# Altium schematic sheet STM32H750.SchDoc
size A3
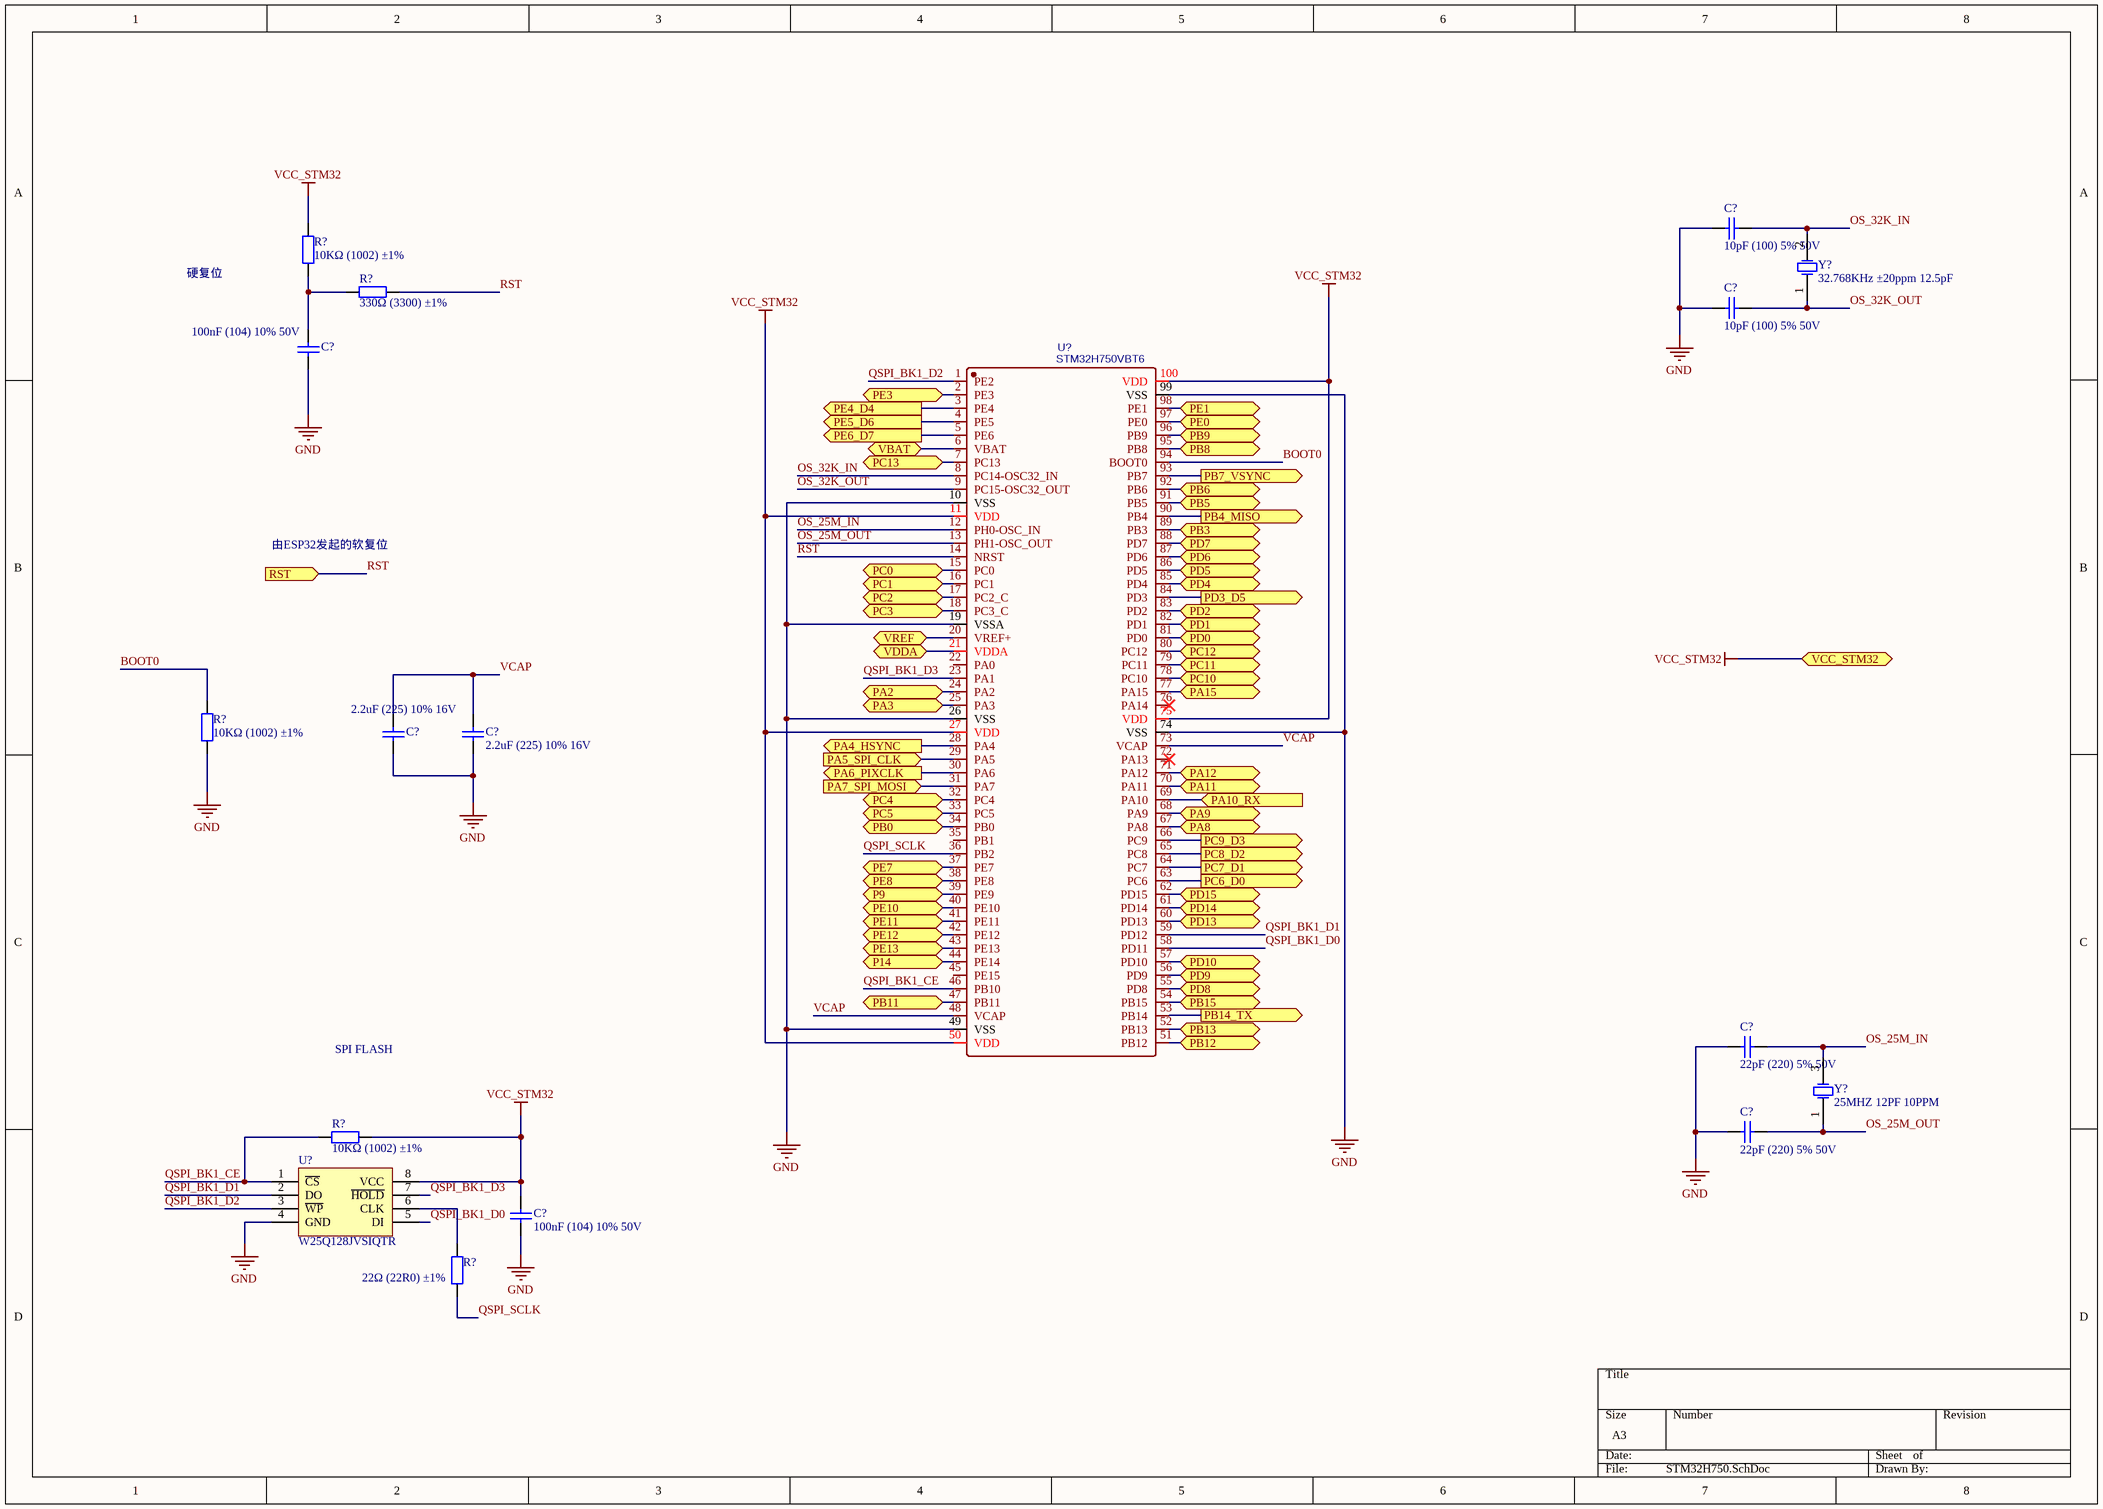
[diagram p0: STM32H750.SchDoc]

## Parts
(Parts that share a designator on the sheet are numbered #1, #2 ... from top to bottom, then left to right.)
C?#1  10pF (100) 5% 50V  [0603_C]
C?#2  10pF (100) 5% 50V  [0603_C]
C?#3  100nF (104) 10% 50V  [0603_C]
C?#4  2.2uF (225) 10% 16V  [0603_C]
C?#5  2.2uF (225) 10% 16V  [0603_C]
C?#6  22pF (220) 5% 50V  [0603_C]
C?#7  22pF (220) 5% 50V  [0603_C]
C?#8  100nF (104) 10% 50V  [0603_C]
R?#1  10KΩ (1002) ±1%  [0603_R]
R?#2  330Ω (3300) ±1%  [0603_R]
R?#3  10KΩ (1002) ±1%  [0603_R]
R?#4  10KΩ (1002) ±1%  [0603_R]
R?#5  22Ω (22R0) ±1%  [0603_R]
U?#1  STM32H750VBT6  [stm32h750vbt6]
U?#2  W25Q128JVSIQTR  [SOIC-8_208mil]
Y?#1  32.768KHz ±20ppm 12.5pF  [SMD-3215_2P FC - 135]
Y?#2  25MHZ 12PF 10PPM  [SMD-3225_4P]

## Ports
P9 (bidir), P14 (bidir), PA2 (bidir), PA3 (bidir), PA4_HSYNC (out), PA5_SPI_CLK (in), PA6_PIXCLK (out), PA7_SPI_MOSI (in), PA8 (bidir), PA9 (bidir), PA10_RX (in), PA11 (bidir), PA12 (bidir), PA15 (bidir), PB0 (bidir), PB3 (bidir), PB4_MISO (out), PB5 (bidir), PB6 (bidir), PB7_VSYNC (out), PB8 (bidir), PB9 (bidir), PB11 (bidir), PB12 (bidir), PB13 (bidir), PB14_TX (out), PB15 (bidir), PC0 (bidir), PC1 (bidir), PC2 (bidir), PC3 (bidir), PC4 (bidir), PC5 (bidir), PC6_D0 (out), PC7_D1 (out), PC8_D2 (out), PC9_D3 (out), PC10 (bidir), PC11 (bidir), PC12 (bidir), PC13 (bidir), PD0 (bidir), PD1 (bidir), PD2 (bidir), PD3_D5 (out), PD4 (bidir), PD5 (bidir), PD6 (bidir), PD7 (bidir), PD8 (bidir), PD9 (bidir), PD10 (bidir), PD13 (bidir), PD14 (bidir), PD15 (bidir), PE0 (bidir), PE1 (bidir), PE3 (bidir), PE4_D4 (out), PE5_D6 (out), PE6_D7 (out), PE7 (bidir), PE8 (bidir), PE10 (bidir), PE11 (bidir), PE12 (bidir), PE13 (bidir), RST (in), VBAT (bidir), VCC_STM32 (bidir), VDDA (bidir), VREF (bidir)

## Nets
GND: C?#1.1 C?#2.1 C?#3.1 C?#4.1 C?#5.1 C?#6.1 C?#7.1 C?#8.1 R?#3.1 U?#1.10(VSS) U?#1.19(VSSA) U?#1.26(VSS) U?#1.49(VSS) U?#1.74(VSS) U?#1.99(VSS) U?#2.4(GND)
VCC_STM32: C?#8.2 R?#1.2 R?#4.2 U?#1.11(VDD) U?#1.27(VDD) U?#1.50(VDD) U?#1.75(VDD) U?#1.100(VDD) U?#2.8(VCC) ; port VCC_STM32
BOOT0: R?#3.2 U?#1.94(BOOT0)
OS_25M_IN: C?#6.2 U?#1.12(PH0-OSC_IN) Y?#2.3(OSC2)
OS_25M_OUT: C?#7.2 U?#1.13(PH1-OSC_OUT) Y?#2.1(OSC1)
OS_32K_IN: C?#1.2 U?#1.8(PC14-OSC32_IN) Y?#1.2(OSC2)
OS_32K_OUT: C?#2.2 U?#1.9(PC15-OSC32_OUT) Y?#1.1(OSC1)
P9: U?#1.39(PE9) ; port P9
P14: U?#1.44(PE14) ; port P14
PA2: U?#1.24(PA2) ; port PA2
PA3: U?#1.25(PA3) ; port PA3
PA4_HSYNC: U?#1.28(PA4) ; port PA4_HSYNC
PA5_SPI_CLK: U?#1.29(PA5) ; port PA5_SPI_CLK
PA6_PIXCLK: U?#1.30(PA6) ; port PA6_PIXCLK
PA7_SPI_MOSI: U?#1.31(PA7) ; port PA7_SPI_MOSI
PA8: U?#1.67(PA8) ; port PA8
PA9: U?#1.68(PA9) ; port PA9
PA10_RX: U?#1.69(PA10) ; port PA10_RX
PA11: U?#1.70(PA11) ; port PA11
PA12: U?#1.71(PA12) ; port PA12
PA15: U?#1.77(PA15) ; port PA15
PB0: U?#1.34(PB0) ; port PB0
PB3: U?#1.89(PB3) ; port PB3
PB4_MISO: U?#1.90(PB4) ; port PB4_MISO
PB5: U?#1.91(PB5) ; port PB5
PB6: U?#1.92(PB6) ; port PB6
PB7_VSYNC: U?#1.93(PB7) ; port PB7_VSYNC
PB8: U?#1.95(PB8) ; port PB8
PB9: U?#1.96(PB9) ; port PB9
PB11: U?#1.47(PB11) ; port PB11
PB12: U?#1.51(PB12) ; port PB12
PB13: U?#1.52(PB13) ; port PB13
PB14_TX: U?#1.53(PB14) ; port PB14_TX
PB15: U?#1.54(PB15) ; port PB15
PC0: U?#1.15(PC0) ; port PC0
PC1: U?#1.16(PC1) ; port PC1
PC2: U?#1.17(PC2_C) ; port PC2
PC3: U?#1.18(PC3_C) ; port PC3
PC4: U?#1.32(PC4) ; port PC4
PC5: U?#1.33(PC5) ; port PC5
PC6_D0: U?#1.63(PC6) ; port PC6_D0
PC7_D1: U?#1.64(PC7) ; port PC7_D1
PC8_D2: U?#1.65(PC8) ; port PC8_D2
PC9_D3: U?#1.66(PC9) ; port PC9_D3
PC10: U?#1.78(PC10) ; port PC10
PC11: U?#1.79(PC11) ; port PC11
PC12: U?#1.80(PC12) ; port PC12
PC13: U?#1.7(PC13) ; port PC13
PD0: U?#1.81(PD0) ; port PD0
PD1: U?#1.82(PD1) ; port PD1
PD2: U?#1.83(PD2) ; port PD2
PD3_D5: U?#1.84(PD3) ; port PD3_D5
PD4: U?#1.85(PD4) ; port PD4
PD5: U?#1.86(PD5) ; port PD5
PD6: U?#1.87(PD6) ; port PD6
PD7: U?#1.88(PD7) ; port PD7
PD8: U?#1.55(PD8) ; port PD8
PD9: U?#1.56(PD9) ; port PD9
PD10: U?#1.57(PD10) ; port PD10
PD13: U?#1.60(PD13) ; port PD13
PD14: U?#1.61(PD14) ; port PD14
PD15: U?#1.62(PD15) ; port PD15
PE0: U?#1.97(PE0) ; port PE0
PE1: U?#1.98(PE1) ; port PE1
PE3: U?#1.2(PE3) ; port PE3
PE4_D4: U?#1.3(PE4) ; port PE4_D4
PE5_D6: U?#1.4(PE5) ; port PE5_D6
PE6_D7: U?#1.5(PE6) ; port PE6_D7
PE7: U?#1.37(PE7) ; port PE7
PE8: U?#1.38(PE8) ; port PE8
PE10: U?#1.40(PE10) ; port PE10
PE11: U?#1.41(PE11) ; port PE11
PE12: U?#1.42(PE12) ; port PE12
PE13: U?#1.43(PE13) ; port PE13
QSPI_BK1_CE: R?#4.1 U?#1.46(PB10) U?#2.1(~{CS})
QSPI_BK1_D0: U?#1.58(PD11) U?#2.5(DI)
QSPI_BK1_D1: U?#1.59(PD12) U?#2.2(DO)
QSPI_BK1_D2: U?#1.1(PE2) U?#2.3(~{WP})
QSPI_BK1_D3: U?#1.23(PA1) U?#2.7(~{HOLD})
QSPI_SCLK: R?#5.1 U?#1.36(PB2)
RST: R?#2.2 U?#1.14(NRST) ; port RST
VBAT: U?#1.6(VBAT) ; port VBAT
VCAP: C?#4.2 C?#5.2 U?#1.48(VCAP) U?#1.73(VCAP)
VDDA: U?#1.21(VDDA) ; port VDDA
VREF: U?#1.20(VREF+) ; port VREF
NetC?#3_2: C?#3.2 R?#1.1 R?#2.1
NetR?#5_2: R?#5.2 U?#2.6(CLK)

Not connected (* = marked no-connect by the designer): U?#1 22(PA0) 35(PB1) 45(PE15) 72(PA13)* 76(PA14)*

## Notes on the sheet
- 硬复位
- 由ESP32发起的软复位
- SPI FLASH

## Library data of the parts
C?#1 C?#2 = 0603 10pF (100) 5% 50V: 贴片电容; ComponentLink1Description: 供应商链接; ComponentLink1URL: http://www.szlcsc.com/product/details_1986.html; Package: 0603; Supplier: LC; SuppliersPartNumber: C1634
C?#3 C?#8 = 0603 100nF (104) 10% 50V: 贴片电容; ComponentLink1Description: 供应商链接; ComponentLink1URL: http://www.szlcsc.com/product/details_15331.html; Package: 0603; Supplier: LC; SuppliersPartNumber: C14663
C?#4 C?#5 = 0603 2.2uF (225) 10% 16V: 贴片电容; ComponentLink1Description: 供应商链接; ComponentLink1URL: http://www.szlcsc.com/product/details_24366.html; Package: 0603; Supplier: LC; SuppliersPartNumber: C23630
C?#6 C?#7 = 0603 22pF (220) 5% 50V: 贴片电容; ComponentLink1Description: 供应商链接; ComponentLink1URL: http://www.szlcsc.com/product/details_2005.html; Package: 0603; Supplier: LC; SuppliersPartNumber: C1653
R?#1 R?#3 R?#4 = 0603 10KΩ (1002) 1%: 贴片电阻; ComponentLink1Description: 供应商链接; ComponentLink1URL: http://www.szlcsc.com/product/details_26547.html; Package: 0603; Supplier: LC; SuppliersPartNumber: C25804
R?#2 = 0603 330Ω (3300) 1%: 贴片电阻; ComponentLink1Description: 供应商链接; ComponentLink1URL: http://www.szlcsc.com/product/details_23865.html; Package: 0603; Supplier: LC; SuppliersPartNumber: C23138
R?#5 = 0603 22Ω (22R0) 1%: 贴片电阻; ComponentLink1Description: 供应商链接; ComponentLink1URL: http://www.szlcsc.com/product/details_24078.html; Package: 0603; Supplier: LC; SuppliersPartNumber: C23345
U?#1 = STM32H750VBT6: BOM_Manufacturer: STMicroelectronics; Contributor: LCSC; SMT Type: Extend; BOM_Supplier: LCSC; BOM_Supplier Part: C404010; BOM_Manufacturer Part: STM32H750VBT6; BOM_JLCPCB SMD: Yes; spicePre: U; spiceSymbolName: STM32H750VBT6
U?#2 = W25Q128JVSIQTR_[C97521]: Flash ROM; ComponentLink1Description: 供应商链接; ComponentLink1URL: https://item.szlcsc.com/98729.html; Package: SOIC-8; Supplier: LC; SuppliersPartNumber: C97521
Y?#1 = SMD-3215_2P 32.768KHz 20ppm 12.5pF: 贴片晶振; ComponentLink1Description: 供应商链接; ComponentLink1URL: http://www.szlcsc.com/product/details_33310.html; Package: SMD-3215_2P; Supplier: LC; SuppliersPartNumber: C32346
Y?#2 = SMD-3225_4P  25MHZ 12PF 10PPM: 贴片晶振; ComponentLink1Description: 供应商链接; ComponentLink1URL: http://www.szlcsc.com/product/details_9526.html; Package: SMD-3225_4P; Supplier: LC; SuppliersPartNumber: C9006